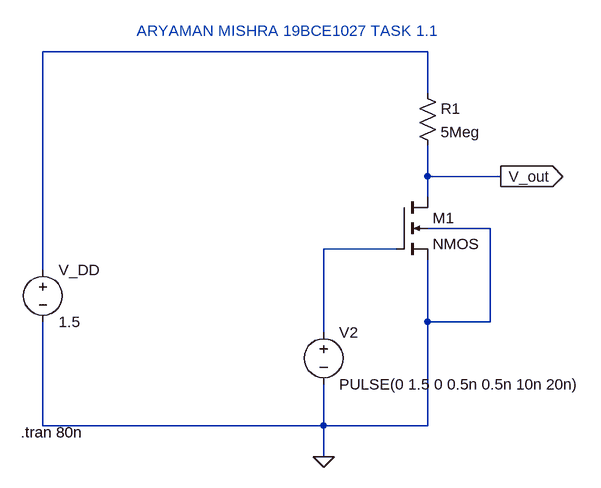
[diagram p0: schematic Draft2.asc]
Draft2.asc, the LTspice schematic file:
Version 4
SHEET 1 916 680
WIRE 656 -16 64 -16
WIRE 656 48 656 -16
WIRE 656 176 656 128
WIRE 768 176 656 176
WIRE 656 208 656 176
WIRE 752 256 656 256
WIRE 608 288 496 288
WIRE 64 320 64 -16
WIRE 656 400 656 304
WIRE 752 400 752 256
WIRE 752 400 656 400
WIRE 496 416 496 288
WIRE 64 560 64 400
WIRE 496 560 496 496
WIRE 496 560 64 560
WIRE 656 560 656 400
WIRE 656 560 496 560
WIRE 496 608 496 560
FLAG 768 176 V_out
IOPIN 768 176 Out
FLAG 496 608 0
SYMBOL voltage 64 304 R0
WINDOW 123 0 0 Left 0
WINDOW 39 0 0 Left 0
SYMATTR InstName V_DD
SYMATTR Value 1.5
SYMBOL voltage 496 400 R0
WINDOW 123 0 0 Left 0
WINDOW 39 0 0 Left 0
SYMATTR InstName V2
SYMATTR Value PULSE(0 1.5 0 0.5n 0.5n 10n 20n)
SYMBOL res 640 32 R0
SYMATTR InstName R1
SYMATTR Value 5Meg
SYMBOL nmos4 608 208 R0
SYMATTR InstName M1
TEXT 30 570 Left 2 !.tran 80n
TEXT 208 -48 Left 2 ;ARYAMAN MISHRA 19BCE1027 TASK 1.1

The netlist it stands for:
* Draft2.asc
V_DD N001 0 1.5
V2 N002 0 PULSE(0 1.5 0 0.5n 0.5n 10n 20n)
R1 N001 V_out 5Meg
M1 V_out N002 0 0 NMOS
.model NMOS NMOS
.model PMOS PMOS
.lib standard.mos
.tran 80n
* ARYAMAN MISHRA 19BCE1027 TASK 1.1
.backanno
.end